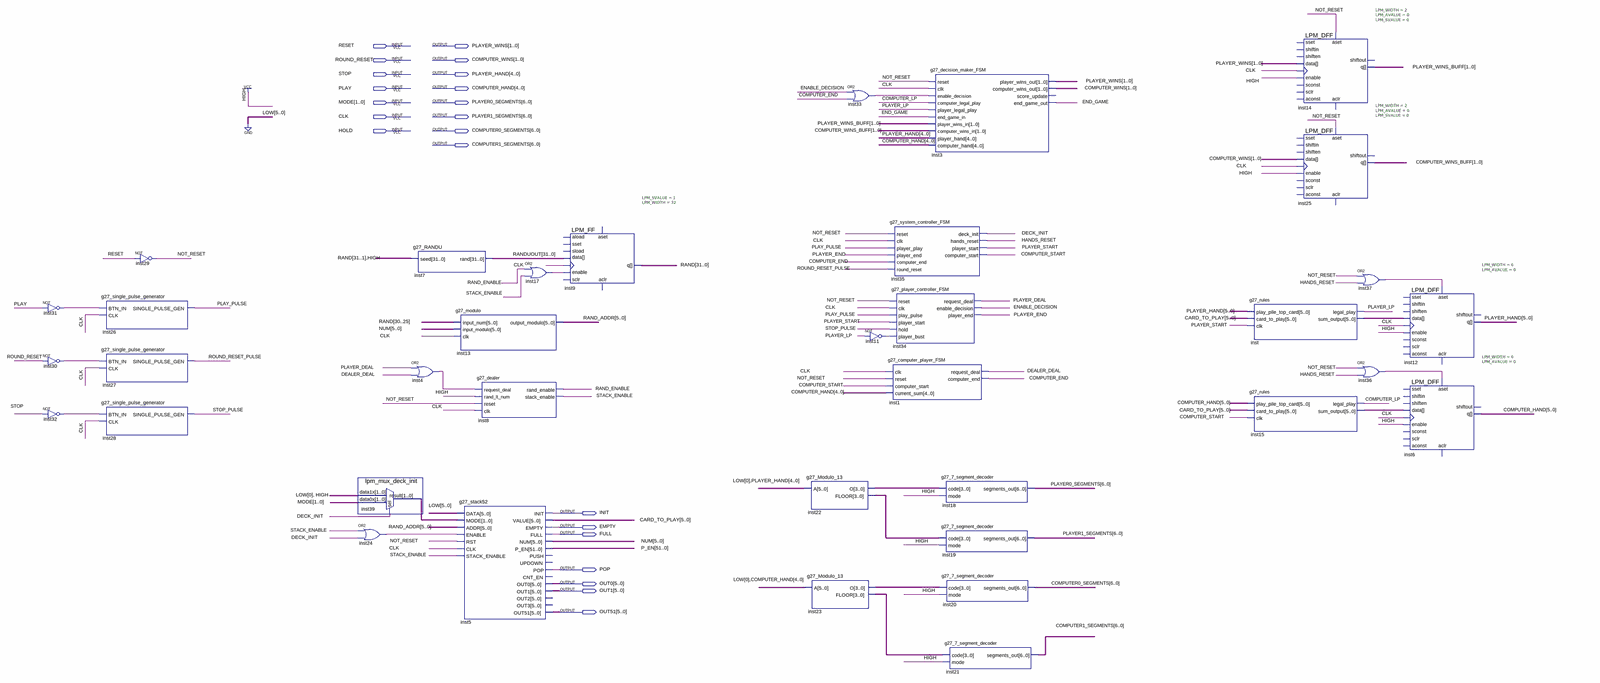
[diagram p0: schematic sheet, whole]
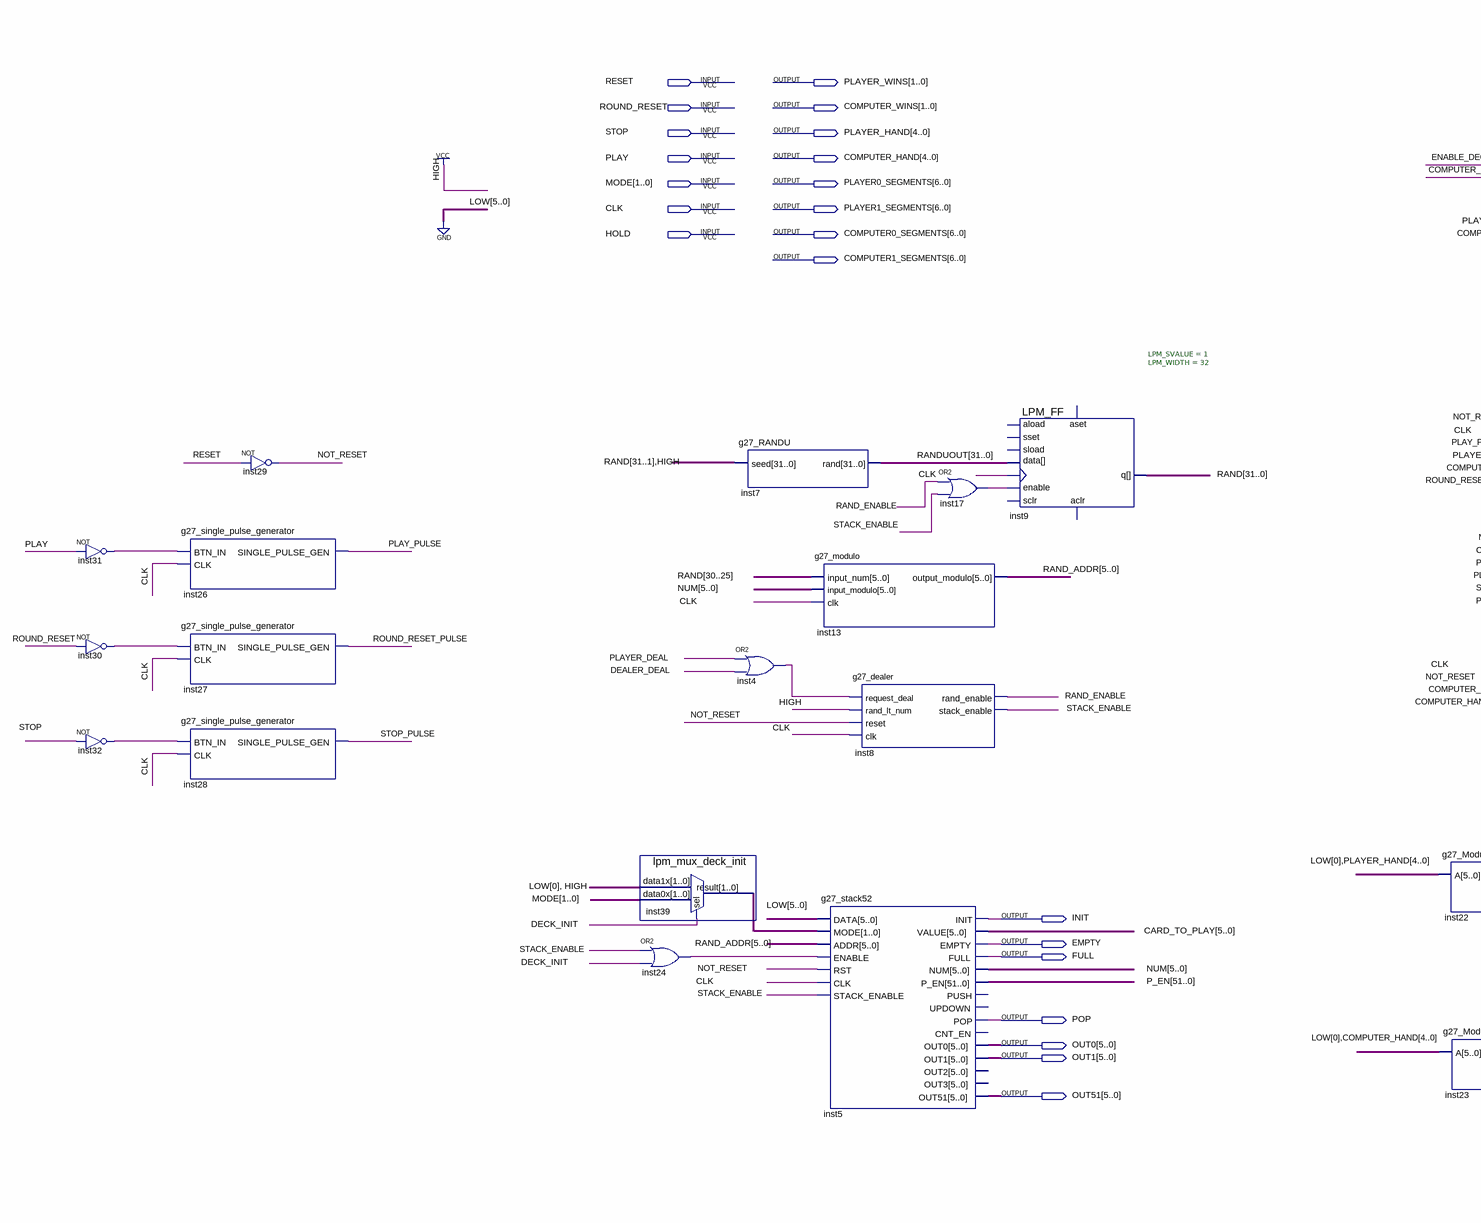
[diagram p1: schematic sheet, left part]
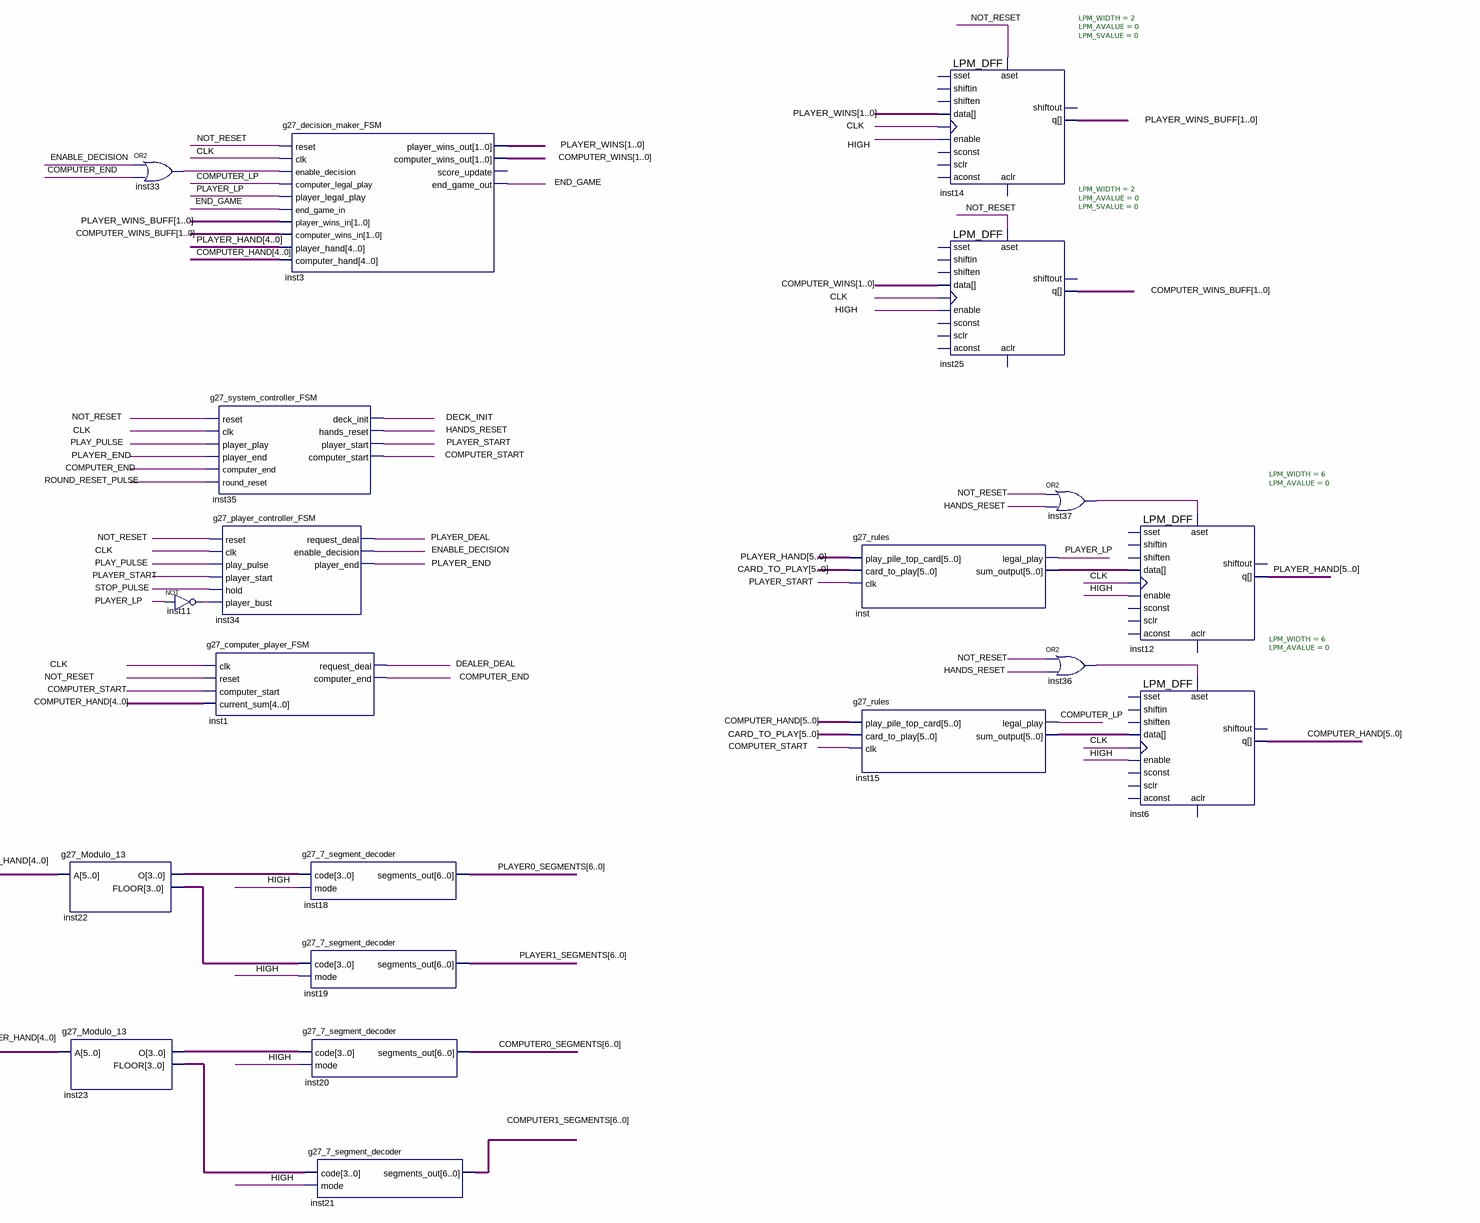
[diagram p2: schematic sheet, right part]
// Quartus schematic g27_21game.bdf as structural Verilog: 36 symbols, 22 pins
module g27_21game (
  input  RESET,
  input  ROUND_RESET,
  input  STOP,
  input  PLAY,
  input  [1:0] MODE,
  input  CLK,
  input  HOLD,
  output [1:0] PLAYER_WINS,
  output [1:0] COMPUTER_WINS,
  output [5:0] PLAYER_HAND,
  output [5:0] COMPUTER_HAND,
  output [6:0] PLAYER0_SEGMENTS,
  output [6:0] PLAYER1_SEGMENTS,
  output [6:0] COMPUTER0_SEGMENTS,
  output [6:0] COMPUTER1_SEGMENTS,
  output INIT,
  output EMPTY,
  output FULL,
  output POP,
  output [5:0] OUT0,
  output [5:0] OUT1,
  output [5:0] OUT51
);

  wire COMPUTER_END, COMPUTER_LP, COMPUTER_START, DEALER_DEAL, DECK_INIT, ENABLE_DECISION, END_GAME,
       HANDS_RESET, inst4_out, inst11_out, inst17_out, inst24_out, inst30_out, inst31_out, inst32_out,
       inst33_out, inst36_out, inst37_out, NOT_RESET, PLAY_PULSE, PLAYER_DEAL, PLAYER_END, PLAYER_LP,
       PLAYER_START, RAND_ENABLE, ROUND_RESET_PULSE, STACK_ENABLE, STOP_PULSE;
  wire [1:0] COMPUTER_WINS_BUFF, inst39_result, PLAYER_WINS_BUFF;
  wire [3:0] inst22_floor, inst22_o, inst23_floor, inst23_o;
  wire [5:0] CARD_TO_PLAY, inst15_sum_output, inst_sum_output, NUM, RAND_ADDR;
  wire [31:0] RAND, RANDUOUT;
  wire [51:0] P_EN;

  not inst31 (inst31_out, PLAY);
  not inst30 (inst30_out, ROUND_RESET);
  not inst32 (inst32_out, STOP);
  g27_single_pulse_generator inst26 (.BTN_IN(inst31_out), .CLK(CLK), .SINGLE_PULSE_GEN(PLAY_PULSE));
  g27_single_pulse_generator inst27 (.BTN_IN(inst30_out), .CLK(CLK), .SINGLE_PULSE_GEN(ROUND_RESET_PULSE));
  g27_single_pulse_generator inst28 (.BTN_IN(inst32_out), .CLK(CLK), .SINGLE_PULSE_GEN(STOP_PULSE));
  not inst29 (NOT_RESET, RESET);
  lpm_mux_deck_init inst39 (.data1x(2'b01), .data0x(MODE), .sel(DECK_INIT), .result(inst39_result));
  or inst24 (inst24_out, STACK_ENABLE, DECK_INIT);
  g27_RANDU inst7 (.seed({RAND[31:1], 1'b1}), .\rand (RANDUOUT));
  or inst4 (inst4_out, PLAYER_DEAL, DEALER_DEAL);
  g27_modulo inst13 (.input_num(RAND[30:25]), .input_modulo(NUM), .clk(CLK), .output_modulo(RAND_ADDR));
  g27_stack52 inst5 (
    .DATA({6{1'b0}}), .MODE(inst39_result), .ADDR(RAND_ADDR), .ENABLE(inst24_out), .RST(NOT_RESET),
    .CLK(CLK), .STACK_ENABLE(STACK_ENABLE), .INIT(INIT), .VALUE(CARD_TO_PLAY), .EMPTY(EMPTY), .FULL(FULL),
    .NUM(NUM), .P_EN(P_EN), .POP(POP), .OUT0(OUT0), .OUT1(OUT1), .OUT51(OUT51));  // open: PUSH, UPDOWN, CNT_EN, OUT2, OUT3
  g27_dealer inst8 (
    .request_deal(inst4_out), .rand_lt_num(1'b1), .reset(NOT_RESET), .clk(CLK), .rand_enable(RAND_ENABLE),
    .stack_enable(STACK_ENABLE));
  or inst17 (inst17_out, RAND_ENABLE, STACK_ENABLE);
  LPM_FF #(.LPM_SVALUE(1), .LPM_WIDTH(32)) inst9 (
    .enable(inst17_out), .clock(CLK), .data(RANDUOUT), .q(RAND));  // open: aload, sset, sload, aset, sclr, aclr
  g27_Modulo_13 inst22 (.A({1'b0, PLAYER_HAND[4:0]}), .O(inst22_o), .FLOOR(inst22_floor));
  g27_Modulo_13 inst23 (.A({1'b0, COMPUTER_HAND[4:0]}), .O(inst23_o), .FLOOR(inst23_floor));
  or inst33 (inst33_out, ENABLE_DECISION, COMPUTER_END);
  not inst11 (inst11_out, PLAYER_LP);
  g27_system_controller_FSM inst35 (
    .reset(NOT_RESET), .clk(CLK), .player_play(PLAY_PULSE), .player_end(PLAYER_END),
    .computer_end(COMPUTER_END), .round_reset(ROUND_RESET_PULSE), .deck_init(DECK_INIT),
    .hands_reset(HANDS_RESET), .player_start(PLAYER_START), .computer_start(COMPUTER_START));
  g27_player_controller_FSM inst34 (
    .reset(NOT_RESET), .clk(CLK), .play_pulse(PLAY_PULSE), .player_start(PLAYER_START), .hold(STOP_PULSE),
    .player_bust(inst11_out), .request_deal(PLAYER_DEAL), .enable_decision(ENABLE_DECISION),
    .player_end(PLAYER_END));
  g27_computer_player_FSM inst1 (
    .clk(CLK), .reset(NOT_RESET), .computer_start(COMPUTER_START), .current_sum(COMPUTER_HAND[4:0]),
    .request_deal(DEALER_DEAL), .computer_end(COMPUTER_END));
  g27_decision_maker_FSM inst3 (
    .reset(NOT_RESET), .clk(CLK), .enable_decision(inst33_out), .computer_legal_play(COMPUTER_LP),
    .player_legal_play(PLAYER_LP), .end_game_in(END_GAME), .player_wins_in(PLAYER_WINS_BUFF),
    .computer_wins_in(COMPUTER_WINS_BUFF), .player_hand(PLAYER_HAND[4:0]),
    .computer_hand(COMPUTER_HAND[4:0]), .player_wins_out(PLAYER_WINS), .computer_wins_out(COMPUTER_WINS),
    .end_game_out(END_GAME));  // open: score_update
  g27_7_segment_decoder inst18 (.code(inst22_o), .mode(1'b1), .segments_out(PLAYER0_SEGMENTS));
  g27_7_segment_decoder inst19 (.code(inst22_floor), .mode(1'b1), .segments_out(PLAYER1_SEGMENTS));
  g27_7_segment_decoder inst20 (.code(inst23_o), .mode(1'b1), .segments_out(COMPUTER0_SEGMENTS));
  g27_7_segment_decoder inst21 (.code(inst23_floor), .mode(1'b1), .segments_out(COMPUTER1_SEGMENTS));
  g27_rules inst (
    .play_pile_top_card(PLAYER_HAND), .card_to_play(CARD_TO_PLAY), .clk(PLAYER_START),
    .legal_play(PLAYER_LP), .sum_output(inst_sum_output));
  g27_rules inst15 (
    .play_pile_top_card(COMPUTER_HAND), .card_to_play(CARD_TO_PLAY), .clk(COMPUTER_START),
    .legal_play(COMPUTER_LP), .sum_output(inst15_sum_output));
  LPM_DFF #(.LPM_WIDTH(2), .LPM_AVALUE(0), .LPM_SVALUE(0)) inst14 (
    .enable(1'b1), .clock(CLK), .data(PLAYER_WINS), .aset(NOT_RESET), .q(PLAYER_WINS_BUFF));  // open: shiftin, shiften, aconst, sclr, sconst, sset, aclr, shiftout
  LPM_DFF #(.LPM_WIDTH(2), .LPM_AVALUE(0), .LPM_SVALUE(0)) inst25 (
    .enable(1'b1), .clock(CLK), .data(COMPUTER_WINS), .aset(NOT_RESET), .q(COMPUTER_WINS_BUFF));  // open: shiftin, shiften, aconst, sclr, sconst, sset, aclr, shiftout
  or inst37 (inst37_out, NOT_RESET, HANDS_RESET);
  or inst36 (inst36_out, NOT_RESET, HANDS_RESET);
  LPM_DFF #(.LPM_WIDTH(6), .LPM_AVALUE(0)) inst12 (
    .enable(1'b1), .clock(CLK), .data(inst_sum_output), .aset(inst37_out), .q(PLAYER_HAND));  // open: shiftin, shiften, aconst, sclr, sconst, sset, aclr, shiftout
  LPM_DFF #(.LPM_WIDTH(6), .LPM_AVALUE(0)) inst6 (
    .enable(1'b1), .clock(CLK), .data(inst15_sum_output), .aset(inst36_out), .q(COMPUTER_HAND));  // open: shiftin, shiften, aconst, sclr, sconst, sset, aclr, shiftout
endmodule
